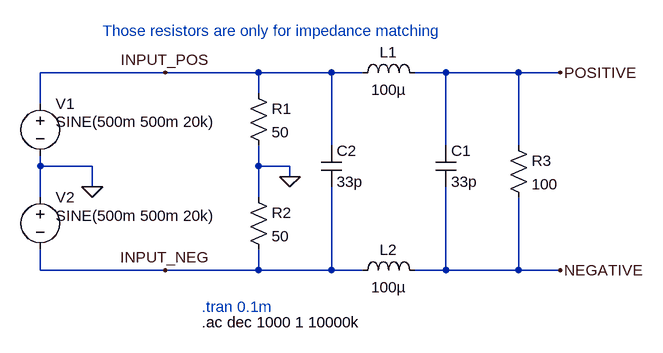
[diagram p0: schematic Differential-LC-low-pass-filter.asc]
Differential-LC-low-pass-filter.asc, the LTspice schematic file:
Version 4.1
SHEET 1 880 680
WIRE -32 80 -224 80
WIRE 112 80 -32 80
WIRE 224 80 112 80
WIRE 272 80 224 80
WIRE 400 80 352 80
WIRE 512 80 400 80
WIRE 576 80 512 80
WIRE 112 112 112 80
WIRE -224 128 -224 80
WIRE 224 192 224 80
WIRE 400 192 400 80
WIRE 512 192 512 80
WIRE -224 224 -224 208
WIRE -144 224 -224 224
WIRE 112 224 112 192
WIRE 160 224 112 224
WIRE 160 240 160 224
WIRE -144 256 -144 224
WIRE -224 272 -224 224
WIRE 112 272 112 224
WIRE -224 384 -224 352
WIRE -32 384 -224 384
WIRE 112 384 112 352
WIRE 112 384 -32 384
WIRE 224 384 224 256
WIRE 224 384 112 384
WIRE 272 384 224 384
WIRE 400 384 400 256
WIRE 400 384 352 384
WIRE 512 384 512 272
WIRE 512 384 400 384
WIRE 576 384 512 384
FLAG 576 80 POSITIVE
FLAG 576 384 NEGATIVE
FLAG -32 80 INPUT_POS
FLAG -32 384 INPUT_NEG
FLAG 160 240 0
FLAG -144 256 0
SYMBOL voltage -224 112 R0
WINDOW 39 0 0 Left 0
WINDOW 3 24 44 Left 2
SYMATTR Value SINE(500m 500m 20k)
SYMATTR Value2 AC 1 1
SYMATTR InstName V1
SYMBOL res 96 96 R0
SYMATTR InstName R1
SYMATTR Value 50
SYMBOL res 96 256 R0
SYMATTR InstName R2
SYMATTR Value 50
SYMBOL voltage -224 256 R0
WINDOW 39 0 0 Left 0
WINDOW 3 24 44 Left 2
SYMATTR Value SINE(500m 500m 20k)
SYMATTR Value2 AC 1 1
SYMATTR InstName V2
SYMBOL res 496 176 R0
SYMATTR InstName R3
SYMATTR Value 100
SYMBOL ind 256 96 R270
WINDOW 0 32 56 VTop 2
WINDOW 3 5 56 VBottom 2
SYMATTR InstName L1
SYMATTR Value 100µ
SYMBOL ind 256 400 R270
WINDOW 0 32 56 VTop 2
WINDOW 3 5 56 VBottom 2
SYMATTR InstName L2
SYMATTR Value 100µ
SYMBOL cap 384 192 R0
SYMATTR InstName C1
SYMATTR Value 33p
SYMBOL cap 208 192 R0
SYMATTR InstName C2
SYMATTR Value 33p
TEXT 24 440 Left 2 ;.tran 0.1m
TEXT 24 464 Left 2 !.ac dec 1000 1 10000k
TEXT -128 16 Left 2 ;Those resistors are only for impedance matching

The netlist it stands for:
* Differential-LC-low-pass-filter.asc
V1 INPUT_POS 0 SINE(500m 500m 20k) AC 1 1
R1 INPUT_POS 0 50
R2 0 INPUT_NEG 50
V2 0 INPUT_NEG SINE(500m 500m 20k) AC 1 1
R3 POSITIVE NEGATIVE 100
L1 INPUT_POS POSITIVE 100µ
L2 INPUT_NEG NEGATIVE 100µ
C1 POSITIVE NEGATIVE 33p
C2 INPUT_POS INPUT_NEG 33p
* .tran 0.1m
.ac dec 1000 1 10000k
* Those resistors are only for impedance matching
.backanno
.end

* Results of the author's LTspice run, read from the files saved beside the schematic
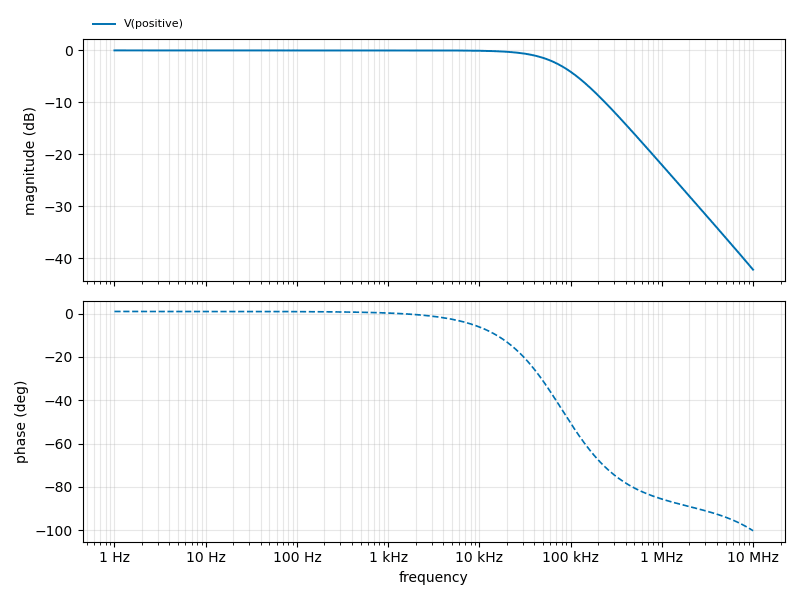
[diagram p1: AC Analysis of Differential-LC-low-pass-filter.asc, plotted from the saved traces]
* AC Analysis, 1 run:
*   V(positive): -0.00 dB at 1 Hz, -42.15 dB at 10 MHz, peak -0.00 dB at 1 Hz, 3 dB below the peak at 79.71 kHz